# Altium schematic sheet ESP32Schematic[1].SchDoc (part 2 of 3)
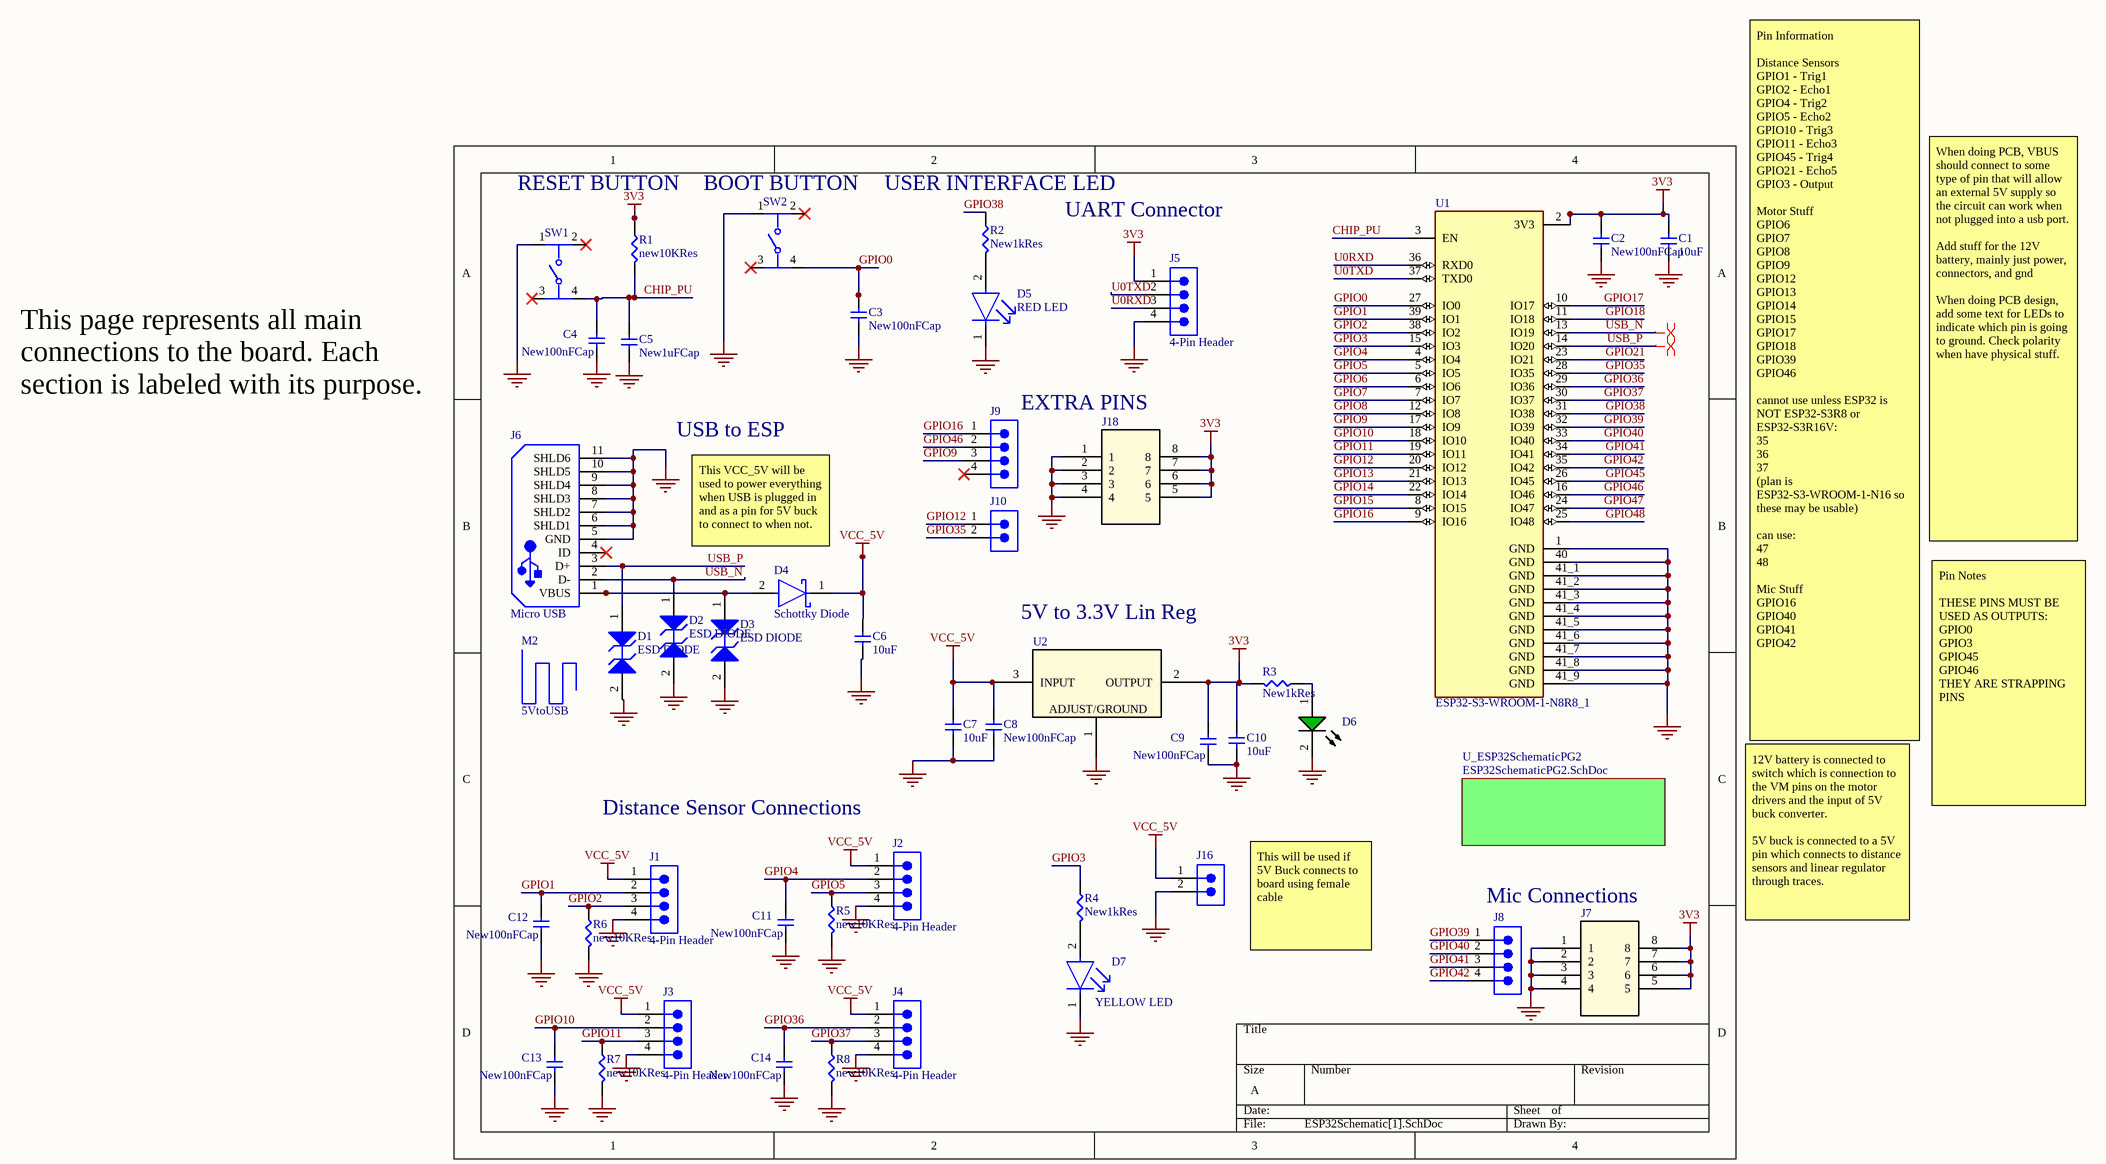
[diagram p1: ESP32Schematic[1].SchDoc]
## Library data of the parts
C1 C6 C7 C10 = C0805C106K3PACTU: 0805 C 10UF Ceramic Multilayer Capacitor, 25 VDC, +85DEGC, X5R Dielec, +/-10%; Manufacturer: KEMET; Value: 10µF; Dissipation Factor: 10%; Voltage: 25V; Supplier: DigiKey; Supplier Part Number: 399-11939-1-ND; Manufacturer Part Number: C0805C106K3PACTU; RoHS: Compliant; Category: Ceramic Capacitors; Stock: 104809; Pricing: 1=0.22, 10=0.126, 50=0.0902, 100=0.0793, 500=0.0609, 1000=0.05524 (USD); Case/Package: 0805; Case Code (Imperial): 0805; Case Code (Metric): 2012; China RoHS: Compliant; Depth: 1.25mm; Dielectric: X5R; Dielectric Material: Ceramic; Height: 1.25mm; Lead Free: Lead Free; Length: 2mm; Lifecycle Status: Production; Material: Ceramic; Max Operating Temperature: 85°C; Min Operating Temperature: -55°C; Mounting Technology: Surface Mount; Number of Terminals: 2; Packaging: Cut Tape; REACH SVHC: Yes; Schedule B: 8532240020; Termination: Solder; Tolerance: 10%; Voltage Rating: 25V; Voltage Rating (DC): 25V; Width: 1.25mm; ComponentLink1URL: https://datasheet.octopart.com:443/C0805C106K3PAC7800-KEMET-datasheet-179100169.pdf?src-supplier=IHS; ComponentLink1Description: https://datasheet.octopart.com:443/C0805C106K3PAC7800-KEMET-datasheet-179100169.pdf?src-supplier=IHS; ComponentLink2URL: https://datasheet.octopart.com:443/C0805C106K3PACTU-KEMET-datasheet-178499189.pdf?src-supplier=IHS; ComponentLink2Description: https://datasheet.octopart.com:443/C0805C106K3PACTU-KEMET-datasheet-178499189.pdf?src-supplier=IHS; ComponentLink3URL: https://datasheet.octopart.com:443/C0805C106K3PACTU-KEMET-datasheet-137357760.pdf?src-supplier=Upverter; ComponentLink3Description: https://datasheet.octopart.com:443/C0805C106K3PACTU-KEMET-datasheet-137357760.pdf?src-supplier=Upverter; ComponentLink4URL: https://datasheet.octopart.com:443/C0805C106K3PACTU-KEMET-datasheet-149523942.pdf?src-supplier=Farnell; ComponentLink4Description: https://datasheet.octopart.com:443/C0805C106K3PACTU-KEMET-datasheet-149523942.pdf?src-supplier=Farnell; ComponentLink5URL: https://datasheet.octopart.com:443/C0805C106K3PACTU-KEMET-datasheet-102649117.pdf?src-supplier=Farnell; ComponentLink5Description: https://datasheet.octopart.com:443/C0805C106K3PACTU-KEMET-datasheet-102649117.pdf?src-supplier=Farnell; ComponentLink6URL: https://datasheet.octopart.com:443/C0805C106K3PACTU-KEMET-datasheet-181957627.pdf?src-supplier=Farnell; ComponentLink6Description: https://datasheet.octopart.com:443/C0805C106K3PACTU-KEMET-datasheet-181957627.pdf?src-supplier=Farnell; ComponentLink7URL: https://datasheet.octopart.com:443/C0805C106K3PACTU-KEMET-datasheet-181957626.pdf?src-supplier=Farnell; ComponentLink7Description: https://datasheet.octopart.com:443/C0805C106K3PACTU-KEMET-datasheet-181957626.pdf?src-supplier=Farnell; ComponentLink8URL: https://datasheet.octopart.com:443/C0805C106K3PACTU-KEMET-datasheet-83957821.pdf?src-supplier=TME; ComponentLink8Description: https://datasheet.octopart.com:443/C0805C106K3PACTU-KEMET-datasheet-83957821.pdf?src-supplier=TME; ComponentLink9URL: https://datasheet.octopart.com:443/C0805C106K3PACTU-KEMET-datasheet-101383854.pdf?src-supplier=TME; ComponentLink9Description: https://datasheet.octopart.com:443/C0805C106K3PACTU-KEMET-datasheet-101383854.pdf?src-supplier=TME; ComponentLink10URL: https://datasheet.octopart.com:443/C0805C106K3PACTU-Kemet-datasheet-46909776.pdf?src-supplier=element14+APAC; ComponentLink10Description: https://datasheet.octopart.com:443/C0805C106K3PACTU-Kemet-datasheet-46909776.pdf?src-supplier=element14+APAC; ComponentLink11URL: https://datasheet.octopart.com:443/C0805C106K3PACTU-Kemet-datasheet-66076755.pdf?src-supplier=element14+APAC; ComponentLink11Description: https://datasheet.octopart.com:443/C0805C106K3PACTU-Kemet-datasheet-66076755.pdf?src-supplier=element14+APAC; ComponentLink12URL: https://datasheet.octopart.com:443/C0805C106K3PACTU-KEMET-datasheet-81638446.pdf?src-supplier=Newark; ComponentLink12Description: https://datasheet.octopart.com:443/C0805C106K3PACTU-KEMET-datasheet-81638446.pdf?src-supplier=Newark; ComponentLink13URL: https://datasheet.octopart.com:443/C0805C106K3PACTU-KEMET-datasheet-176289602.pdf?src-supplier=Newark; ComponentLink13Description: https://datasheet.octopart.com:443/C0805C106K3PACTU-KEMET-datasheet-176289602.pdf?src-supplier=Newark; ComponentLink14URL: https://datasheet.octopart.com:443/C0805C106K3PACTU-KEMET-datasheet-86448548.pdf?src-supplier=Newark; ComponentLink14Description: https://datasheet.octopart.com:443/C0805C106K3PACTU-KEMET-datasheet-86448548.pdf?src-supplier=Newark; ComponentLink15URL: https://datasheet.octopart.com:443/C0805C106K3PACTU-KEMET-datasheet-110724400.pdf?src-supplier=RS+(Formerly+Allied+Electronics); ComponentLink15Description: https://datasheet.octopart.com:443/C0805C106K3PACTU-KEMET-datasheet-110724400.pdf?src-supplier=RS+(Formerly+Allied+Electronics); ComponentLink16URL: https://datasheet.octopart.com/C0805C106K3PACTU-KEMET-datasheet-84169754.pdf; ComponentLink16Description: https://datasheet.octopart.com/C0805C106K3PACTU-KEMET-datasheet-84169754.pdf
C2-C4 C8 C9 C11-C14 = C0805C104K3RACTU: 25V 100nF X7R ±10% 0805 Multilayer Ceramic Capacitors MLCC - SMD/SMT ROHS; Manufacturer: KEMET; Temperature Coefficient: 30ppm/°C; Supplier: DigiKey; Supplier Part Number: 399-C0805C104K3RACTUCT-ND; Manufacturer Part Number: C0805C104K3RACTU; RoHS: Compliant; Category: Ceramic Capacitors; Stock: 1480282; Pricing: 1=0.11, 10=0.062, 50=0.0428, 100=0.0371, 500=0.02736, 1000=0.02438, 4000=0.01952, 8000=0.01719, 12000=0.01709, 20000=0.01653, 28000=0.016, 40000=0.01548, 48000=0.01524, 96000=0.01442, 100000=0.01438 (USD); Value: 100nF; Case/Package: 0805; Case Code (Imperial): 0805; China RoHS: Compliant; Contact Plating: Tin; Depth: 1.25mm; Dielectric: X7R; Dielectric Material: Ceramic; Height: 780µm; Lead Free: Lead Free; Lead Pitch: 750µm; Length: 2mm; Lifecycle Status: Production; Material: Ceramic; Max Operating Temperature: 125°C; Min Operating Temperature: -55°C; Mounting Technology: Surface Mount; Pins: 2; Number of Terminals: 2; Packaging: Cut Tape; Radiation Hardening: No; REACH SVHC: Yes; Schedule B: 8532240020, 8532240020|8532240020|8532240020|8532240020|8532240020; Termination: SMD/SMT; Thickness: 889µm; Tolerance: 10%; Voltage: 25V; Voltage Rating: 25V; Voltage Rating (DC): 25V; Width: 1.25mm; ComponentLink1URL: https://datasheet.octopart.com:443/C0805C104K3RACTU-KEMET-datasheet-178445679.pdf?src-supplier=IHS; ComponentLink1Description: https://datasheet.octopart.com:443/C0805C104K3RACTU-KEMET-datasheet-178445679.pdf?src-supplier=IHS; ComponentLink2URL: https://datasheet.octopart.com:443/C0805C104K3RAC7800-KEMET-datasheet-182041123.pdf?src-supplier=IHS; ComponentLink2Description: https://datasheet.octopart.com:443/C0805C104K3RAC7800-KEMET-datasheet-182041123.pdf?src-supplier=IHS; ComponentLink3URL: https://datasheet.octopart.com:443/C0805C104K3RACTU-KEMET-datasheet-137357759.pdf?src-supplier=Farnell; ComponentLink3Description: https://datasheet.octopart.com:443/C0805C104K3RACTU-KEMET-datasheet-137357759.pdf?src-supplier=Farnell; ComponentLink4URL: https://datasheet.octopart.com:443/C0805C104K3RAC-TU-Kemet-datasheet-5313890.pdf?src-supplier=Farnell; ComponentLink4Description: https://datasheet.octopart.com:443/C0805C104K3RAC-TU-Kemet-datasheet-5313890.pdf?src-supplier=Farnell; ComponentLink5URL: https://datasheet.octopart.com:443/C0805C104K3RACTU-KEMET-datasheet-100437323.pdf?src-supplier=Farnell; ComponentLink5Description: https://datasheet.octopart.com:443/C0805C104K3RACTU-KEMET-datasheet-100437323.pdf?src-supplier=Farnell; ComponentLink6URL: https://datasheet.octopart.com:443/C0805C104K3RACTU-KEMET-datasheet-176142295.pdf?src-supplier=Farnell; ComponentLink6Description: https://datasheet.octopart.com:443/C0805C104K3RACTU-KEMET-datasheet-176142295.pdf?src-supplier=Farnell; ComponentLink7URL: https://datasheet.octopart.com:443/C0805C104K3RAC-TU-Kemet-datasheet-7833651.pdf?src-supplier=Farnell; ComponentLink7Description: https://datasheet.octopart.com:443/C0805C104K3RAC-TU-Kemet-datasheet-7833651.pdf?src-supplier=Farnell; ComponentLink8URL: https://datasheet.octopart.com:443/C0805C104K3RAC-TU-Kemet-datasheet-7601896.pdf?src-supplier=Farnell; ComponentLink8Description: https://datasheet.octopart.com:443/C0805C104K3RAC-TU-Kemet-datasheet-7601896.pdf?src-supplier=Farnell; ComponentLink9URL: https://datasheet.octopart.com:443/C0805C104K3RAC-TU-Kemet-datasheet-5316294.pdf?src-supplier=Farnell; ComponentLink9Description: https://datasheet.octopart.com:443/C0805C104K3RAC-TU-Kemet-datasheet-5316294.pdf?src-supplier=Farnell; ComponentLink10URL: https://datasheet.octopart.com:443/C0805C104K3RAC-TU-Kemet-datasheet-5314837.pdf?src-supplier=Farnell; ComponentLink10Description: https://datasheet.octopart.com:443/C0805C104K3RAC-TU-Kemet-datasheet-5314837.pdf?src-supplier=Farnell; ComponentLink11URL: https://datasheet.octopart.com:443/C0805C104K3RAC-TU-Kemet-datasheet-8092359.pdf?src-supplier=Farnell; ComponentLink11Description: https://datasheet.octopart.com:443/C0805C104K3RAC-TU-Kemet-datasheet-8092359.pdf?src-supplier=Farnell; ComponentLink12URL: https://datasheet.octopart.com:443/C0805C104K3RAC-TU-Kemet-datasheet-5314449.pdf?src-supplier=Farnell; ComponentLink12Description: https://datasheet.octopart.com:443/C0805C104K3RAC-TU-Kemet-datasheet-5314449.pdf?src-supplier=Farnell; ComponentLink13URL: https://datasheet.octopart.com:443/C0805C104K3RAC-TU-Kemet-datasheet-5390537.pdf?src-supplier=Farnell; ComponentLink13Description: https://datasheet.octopart.com:443/C0805C104K3RAC-TU-Kemet-datasheet-5390537.pdf?src-supplier=Farnell; ComponentLink14URL: https://datasheet.octopart.com:443/C0805C104K3RAC-TU-Kemet-datasheet-5314969.pdf?src-supplier=Farnell; ComponentLink14Description: https://datasheet.octopart.com:443/C0805C104K3RAC-TU-Kemet-datasheet-5314969.pdf?src-supplier=Farnell; ComponentLink15URL: https://datasheet.octopart.com:443/C0805C104K3RAC-TU-Kemet-datasheet-5314627.pdf?src-supplier=Farnell; ComponentLink15Description: https://datasheet.octopart.com:443/C0805C104K3RAC-TU-Kemet-datasheet-5314627.pdf?src-supplier=Farnell; ComponentLink16URL: https://datasheet.octopart.com:443/C0805C104K3RAC-TU-Kemet-datasheet-5389132.pdf?src-supplier=Farnell; ComponentLink16Description: https://datasheet.octopart.com:443/C0805C104K3RAC-TU-Kemet-datasheet-5389132.pdf?src-supplier=Farnell; ComponentLink17URL: https://datasheet.octopart.com:443/C0805C104K3RAC-TU-Kemet-datasheet-5313836.pdf?src-supplier=Farnell; ComponentLink17Description: https://datasheet.octopart.com:443/C0805C104K3RAC-TU-Kemet-datasheet-5313836.pdf?src-supplier=Farnell; ComponentLink18URL: https://datasheet.octopart.com:443/C0805C104K3RAC-TU-Kemet-datasheet-8111010.pdf?src-supplier=Farnell; ComponentLink18Description: https://datasheet.octopart.com:443/C0805C104K3RAC-TU-Kemet-datasheet-8111010.pdf?src-supplier=Farnell; ComponentLink19URL: https://datasheet.octopart.com:443/C0805C104K3RAC-TU-Kemet-datasheet-7541751.pdf?src-supplier=Farnell; ComponentLink19Description: https://datasheet.octopart.com:443/C0805C104K3RAC-TU-Kemet-datasheet-7541751.pdf?src-supplier=Farnell; ComponentLink20URL: https://datasheet.octopart.com:443/C0805C104K3RAC-TU-Kemet-datasheet-7627733.pdf?src-supplier=Farnell; ComponentLink20Description: https://datasheet.octopart.com:443/C0805C104K3RAC-TU-Kemet-datasheet-7627733.pdf?src-supplier=Farnell; ComponentLink21URL: https://datasheet.octopart.com:443/C0805C104K3RAC-TU-Kemet-datasheet-5315946.pdf?src-supplier=Farnell; ComponentLink21Description: https://datasheet.octopart.com:443/C0805C104K3RAC-TU-Kemet-datasheet-5315946.pdf?src-supplier=Farnell; ComponentLink22URL: https://datasheet.octopart.com:443/C0805C104K3RACTU-KEMET-datasheet-68331921.pdf?src-supplier=Upverter; ComponentLink22Description: https://datasheet.octopart.com:443/C0805C104K3RACTU-KEMET-datasheet-68331921.pdf?src-supplier=Upverter; ComponentLink23URL: https://datasheet.octopart.com:443/C0805C104K3RACTU-Kemet-datasheet-12608295.pdf?src-supplier=element14+APAC; ComponentLink23Description: https://datasheet.octopart.com:443/C0805C104K3RACTU-Kemet-datasheet-12608295.pdf?src-supplier=element14+APAC; ComponentLink24URL: https://datasheet.octopart.com:443/C0805C104K3RACTU-Kemet-datasheet-11992184.pdf?src-supplier=element14+APAC; ComponentLink24Description: https://datasheet.octopart.com:443/C0805C104K3RACTU-Kemet-datasheet-11992184.pdf?src-supplier=element14+APAC; ComponentLink25URL: https://datasheet.octopart.com:443/C0805C104K3RACTU-Kemet-datasheet-10942409.pdf?src-supplier=element14+APAC; ComponentLink25Description: https://datasheet.octopart.com:443/C0805C104K3RACTU-Kemet-datasheet-10942409.pdf?src-supplier=element14+APAC; ComponentLink26URL: https://datasheet.octopart.com:443/C0805C104K3RACTU-Kemet-datasheet-10404442.pdf?src-supplier=element14+APAC; ComponentLink26Description: https://datasheet.octopart.com:443/C0805C104K3RACTU-Kemet-datasheet-10404442.pdf?src-supplier=element14+APAC; ComponentLink27URL: https://datasheet.octopart.com:443/C0805C104K3RACTU-Kemet-datasheet-66100807.pdf?src-supplier=element14+APAC; ComponentLink27Description: https://datasheet.octopart.com:443/C0805C104K3RACTU-Kemet-datasheet-66100807.pdf?src-supplier=element14+APAC; ComponentLink28URL: https://datasheet.octopart.com:443/C0805C104K3RACTU-Kemet-datasheet-32036385.pdf?src-supplier=element14+APAC; ComponentLink28Description: https://datasheet.octopart.com:443/C0805C104K3RACTU-Kemet-datasheet-32036385.pdf?src-supplier=element14+APAC; ComponentLink29URL: https://datasheet.octopart.com:443/C0805C104K3RACTU-KEMET-datasheet-37550250.pdf?src-supplier=Electro+Sonic; ComponentLink29Description: https://datasheet.octopart.com:443/C0805C104K3RACTU-KEMET-datasheet-37550250.pdf?src-supplier=Electro+Sonic; ComponentLink30URL: https://datasheet.octopart.com:443/C0805C104K3RACTU-KEMET-datasheet-176289588.pdf?src-supplier=Newark; ComponentLink30Description: https://datasheet.octopart.com:443/C0805C104K3RACTU-KEMET-datasheet-176289588.pdf?src-supplier=Newark; ComponentLink31URL: https://datasheet.octopart.com:443/C0805C104K3RACTU-Kemet-datasheet-27203261.pdf?src-supplier=Newark; ComponentLink31Description: https://datasheet.octopart.com:443/C0805C104K3RACTU-Kemet-datasheet-27203261.pdf?src-supplier=Newark; ComponentLink32URL: https://datasheet.octopart.com:443/C0805C104K3RACTU-KEMET-datasheet-164512540.pdf?src-supplier=TME; ComponentLink32Description: https://datasheet.octopart.com:443/C0805C104K3RACTU-KEMET-datasheet-164512540.pdf?src-supplier=TME; ComponentLink33URL: https://datasheet.octopart.com:443/C0805C104K3RACTU-Kemet-datasheet-67847105.pdf?src-supplier=TME; ComponentLink33Description: https://datasheet.octopart.com:443/C0805C104K3RACTU-Kemet-datasheet-67847105.pdf?src-supplier=TME; ComponentLink34URL: https://datasheet.octopart.com:443/C0805C104K3RACTU-KEMET-datasheet-68331906.pdf?src-supplier=TME; ComponentLink34Description: https://datasheet.octopart.com:443/C0805C104K3RACTU-KEMET-datasheet-68331906.pdf?src-supplier=TME; ComponentLink35URL: https://datasheet.octopart.com:443/C0805C104K3RACTU-KEMET-datasheet-110724412.pdf?src-supplier=RS+(Formerly+Allied+Electronics); ComponentLink35Description: https://datasheet.octopart.com:443/C0805C104K3RACTU-KEMET-datasheet-110724412.pdf?src-supplier=RS+(Formerly+Allied+Electronics); ComponentLink36URL: https://datasheet.octopart.com:443/C0805C104K3RACTU-Kemet-datasheet-464.pdf?src-supplier=RS+(Formerly+Allied+Electronics); ComponentLink36Description: https://datasheet.octopart.com:443/C0805C104K3RACTU-Kemet-datasheet-464.pdf?src-supplier=RS+(Formerly+Allied+Electronics); ComponentLink37URL: https://datasheet.octopart.com/C0805C104K3RACTU-KEMET-datasheet-84169754.pdf; ComponentLink37Description: https://datasheet.octopart.com/C0805C104K3RACTU-KEMET-datasheet-84169754.pdf; ComponentLink38URL: https://datasheet.octopart.com:443/C0805C104K3RACTU-Kemet-datasheet-11780474.pdf?src-supplier=Arrow+Electronics; ComponentLink38Description: https://datasheet.octopart.com:443/C0805C104K3RACTU-Kemet-datasheet-11780474.pdf?src-supplier=Arrow+Electronics; ComponentLink39URL: https://datasheet.octopart.com:443/C0805C104K3RAC-TU-Kemet-datasheet-7628246.pdf?src-supplier=Jameco; ComponentLink39Description: https://datasheet.octopart.com:443/C0805C104K3RAC-TU-Kemet-datasheet-7628246.pdf?src-supplier=Jameco
C5 = C0805C105K3RACTU: Multilayer Ceramic Capacitors MLCC – SMD/SMT; KEMET; C0805C105K3RACTU; 1 µF; 0805; 25 V; 25 V; Value: 1µF; Dielectric: X7R; Tolerance: 10%; Voltage: 25V; Supplier: DigiKey; Supplier Part Number: 399-C0805C105K3RACTUDKR-ND; Manufacturer: KEMET; Manufacturer Part Number: C0805C105K3RACTU; RoHS: Compliant; Category: Ceramic Capacitors; Stock: 337068; Pricing: 1=0.12, 10=0.068, 50=0.0474, 100=0.041, 500=0.03044, 1000=0.02719 (USD); Case/Package: 0805; Case Code (Imperial): 0805; Case Code (Metric): 2012; China RoHS: Compliant; Contact Plating: Tin; Depth: 1.25mm; Dielectric Material: Ceramic; Height: 1.25mm; Length: 2mm; Lifecycle Status: Production; Material: Ceramic; Max Operating Temperature: 125°C; Min Operating Temperature: -55°C; Mounting Technology: Surface Mount; Pins: 2; Number of Terminals: 2; Radiation Hardening: No; REACH SVHC: Yes; Schedule B: 8532240020, 8532240020|8532240020|8532240020|8532240020|8532240020|8532240020|8532240020|8532240020|8532240020|8532240020|8532240020|8532240020|8532240020|8532240020|8532240020|8532240020|8532240020|8532240020|8532240020|8532240020|8532240020|8532240020|8532240020|85; Termination: SMD/SMT; Thickness: 1.397mm; Voltage Rating: 25V; Voltage Rating (DC): 25V; Width: 1.25mm; ComponentLink1URL: https://datasheet.octopart.com:443/C0805C105K3RACTU-KEMET-datasheet-178445679.pdf?src-supplier=IHS; ComponentLink1Description: https://datasheet.octopart.com:443/C0805C105K3RACTU-KEMET-datasheet-178445679.pdf?src-supplier=IHS; ComponentLink2URL: https://datasheet.octopart.com:443/C0805C105K3RACTU-KEMET-datasheet-137357759.pdf?src-supplier=Farnell; ComponentLink2Description: https://datasheet.octopart.com:443/C0805C105K3RACTU-KEMET-datasheet-137357759.pdf?src-supplier=Farnell; ComponentLink3URL: https://datasheet.octopart.com:443/C0805C105K3RACTU-Kemet-datasheet-5313890.pdf?src-supplier=Farnell; ComponentLink3Description: https://datasheet.octopart.com:443/C0805C105K3RACTU-Kemet-datasheet-5313890.pdf?src-supplier=Farnell; ComponentLink4URL: https://datasheet.octopart.com:443/C0805C105K3RACTU-KEMET-datasheet-32036385.pdf?src-supplier=Farnell; ComponentLink4Description: https://datasheet.octopart.com:443/C0805C105K3RACTU-KEMET-datasheet-32036385.pdf?src-supplier=Farnell; ComponentLink5URL: https://datasheet.octopart.com:443/C0805C105K3RACTU-Kemet-datasheet-8764837.pdf?src-supplier=Farnell; ComponentLink5Description: https://datasheet.octopart.com:443/C0805C105K3RACTU-Kemet-datasheet-8764837.pdf?src-supplier=Farnell; ComponentLink6URL: https://datasheet.octopart.com:443/C0805C105K3RACTU-Kemet-datasheet-8480123.pdf?src-supplier=Farnell; ComponentLink6Description: https://datasheet.octopart.com:443/C0805C105K3RACTU-Kemet-datasheet-8480123.pdf?src-supplier=Farnell; ComponentLink7URL: https://datasheet.octopart.com:443/C0805C105K3RACTU-Kemet-datasheet-5390537.pdf?src-supplier=Farnell; ComponentLink7Description: https://datasheet.octopart.com:443/C0805C105K3RACTU-Kemet-datasheet-5390537.pdf?src-supplier=Farnell; ComponentLink8URL: https://datasheet.octopart.com:443/C0805C105K3RACTU-Kemet-datasheet-5393970.pdf?src-supplier=Farnell; ComponentLink8Description: https://datasheet.octopart.com:443/C0805C105K3RACTU-Kemet-datasheet-5393970.pdf?src-supplier=Farnell; ComponentLink9URL: https://datasheet.octopart.com:443/C0805C105K3RACTU-Kemet-datasheet-8502025.pdf?src-supplier=Farnell; ComponentLink9Description: https://datasheet.octopart.com:443/C0805C105K3RACTU-Kemet-datasheet-8502025.pdf?src-supplier=Farnell; ComponentLink10URL: https://datasheet.octopart.com:443/C0805C105K3RACTU-Kemet-datasheet-7541751.pdf?src-supplier=Farnell; ComponentLink10Description: https://datasheet.octopart.com:443/C0805C105K3RACTU-Kemet-datasheet-7541751.pdf?src-supplier=Farnell; ComponentLink11URL: https://datasheet.octopart.com:443/C0805C105K3RACTU-Kemet-datasheet-161801.pdf?src-supplier=Farnell; ComponentLink11Description: https://datasheet.octopart.com:443/C0805C105K3RACTU-Kemet-datasheet-161801.pdf?src-supplier=Farnell; ComponentLink12URL: https://datasheet.octopart.com:443/C0805C105K3RACTU-KEMET-datasheet-149523912.pdf?src-supplier=Farnell; ComponentLink12Description: https://datasheet.octopart.com:443/C0805C105K3RACTU-KEMET-datasheet-149523912.pdf?src-supplier=Farnell; ComponentLink13URL: https://datasheet.octopart.com:443/C0805C105K3RACTU-KEMET-datasheet-68331906.pdf?src-supplier=Farnell; ComponentLink13Description: https://datasheet.octopart.com:443/C0805C105K3RACTU-KEMET-datasheet-68331906.pdf?src-supplier=Farnell; ComponentLink14URL: https://datasheet.octopart.com:443/C0805C105K3RACTU-KEMET-datasheet-101576158.pdf?src-supplier=Farnell; ComponentLink14Description: https://datasheet.octopart.com:443/C0805C105K3RACTU-KEMET-datasheet-101576158.pdf?src-supplier=Farnell; ComponentLink15URL: https://datasheet.octopart.com:443/C0805C105K3RACTU.-Kemet-datasheet-41232427.pdf?src-supplier=Farnell; ComponentLink15Description: https://datasheet.octopart.com:443/C0805C105K3RACTU.-Kemet-datasheet-41232427.pdf?src-supplier=Farnell; ComponentLink16URL: https://datasheet.octopart.com:443/C0805C105K3RACTU-KEMET-datasheet-176142298.pdf?src-supplier=Farnell; ComponentLink16Description: https://datasheet.octopart.com:443/C0805C105K3RACTU-KEMET-datasheet-176142298.pdf?src-supplier=Farnell; ComponentLink17URL: https://datasheet.octopart.com:443/C0805C105K3RACTU-Kemet-datasheet-5340275.pdf?src-supplier=Farnell; ComponentLink17Description: https://datasheet.octopart.com:443/C0805C105K3RACTU-Kemet-datasheet-5340275.pdf?src-supplier=Farnell; ComponentLink18URL: https://datasheet.octopart.com:443/C0805C105K3RAC7800-KEMET-datasheet-188512054.pdf?src-supplier=ODG+(Origin+Data+Global); ComponentLink18Description: https://datasheet.octopart.com:443/C0805C105K3RAC7800-KEMET-datasheet-188512054.pdf?src-supplier=ODG+(Origin+Data+Global); ComponentLink19URL: https://datasheet.octopart.com:443/C0805C105K3RACTU..-Kemet-datasheet-66413465.pdf?src-supplier=element14+APAC; ComponentLink19Description: https://datasheet.octopart.com:443/C0805C105K3RACTU..-Kemet-datasheet-66413465.pdf?src-supplier=element14+APAC; ComponentLink20URL: https://datasheet.octopart.com:443/C0805C105K3RACTU-Kemet-datasheet-23692949.pdf?src-supplier=element14+APAC; ComponentLink20Description: https://datasheet.octopart.com:443/C0805C105K3RACTU-Kemet-datasheet-23692949.pdf?src-supplier=element14+APAC; ComponentLink21URL: https://datasheet.octopart.com:443/C0805C105K3RACTU-Kemet-datasheet-22084244.pdf?src-supplier=element14+APAC; ComponentLink21Description: https://datasheet.octopart.com:443/C0805C105K3RACTU-Kemet-datasheet-22084244.pdf?src-supplier=element14+APAC; ComponentLink22URL: https://datasheet.octopart.com:443/C0805C105K3RACTU-KEMET-datasheet-176289598.pdf?src-supplier=Newark; ComponentLink22Description: https://datasheet.octopart.com:443/C0805C105K3RACTU-KEMET-datasheet-176289598.pdf?src-supplier=Newark; ComponentLink23URL: https://datasheet.octopart.com:443/C0805C105K3RACTU-Kemet-datasheet-12608295.pdf?src-supplier=Newark; ComponentLink23Description: https://datasheet.octopart.com:443/C0805C105K3RACTU-Kemet-datasheet-12608295.pdf?src-supplier=Newark; ComponentLink24URL: https://datasheet.octopart.com:443/C0805C105K3RACTU-Kemet-datasheet-11992184.pdf?src-supplier=Newark; ComponentLink24Description: https://datasheet.octopart.com:443/C0805C105K3RACTU-Kemet-datasheet-11992184.pdf?src-supplier=Newark; ComponentLink25URL: https://datasheet.octopart.com:443/C0805C105K3RACTU-Kemet-datasheet-10942409.pdf?src-supplier=Newark; ComponentLink25Description: https://datasheet.octopart.com:443/C0805C105K3RACTU-Kemet-datasheet-10942409.pdf?src-supplier=Newark; ComponentLink26URL: https://datasheet.octopart.com:443/C0805C105K3RACTU-Kemet-datasheet-10404442.pdf?src-supplier=Newark; ComponentLink26Description: https://datasheet.octopart.com:443/C0805C105K3RACTU-Kemet-datasheet-10404442.pdf?src-supplier=Newark; ComponentLink27URL: https://datasheet.octopart.com:443/C0805C105K3RACTU-KEMET-datasheet-164512540.pdf?src-supplier=TME; ComponentLink27Description: https://datasheet.octopart.com:443/C0805C105K3RACTU-KEMET-datasheet-164512540.pdf?src-supplier=TME; ComponentLink28URL: https://datasheet.octopart.com:443/C0805C105K3RACTU-Kemet-datasheet-67847111.pdf?src-supplier=TME; ComponentLink28Description: https://datasheet.octopart.com:443/C0805C105K3RACTU-Kemet-datasheet-67847111.pdf?src-supplier=TME; ComponentLink29URL: https://datasheet.octopart.com:443/C0805C105K3RACTU-KEMET-datasheet-110724412.pdf?src-supplier=RS+(Formerly+Allied+Electronics); ComponentLink29Description: https://datasheet.octopart.com:443/C0805C105K3RACTU-KEMET-datasheet-110724412.pdf?src-supplier=RS+(Formerly+Allied+Electronics); ComponentLink30URL: https://datasheet.octopart.com:443/C0805C105K3RACTU-Kemet-datasheet-464.pdf?src-supplier=RS+(Formerly+Allied+Electronics); ComponentLink30Description: https://datasheet.octopart.com:443/C0805C105K3RACTU-Kemet-datasheet-464.pdf?src-supplier=RS+(Formerly+Allied+Electronics); ComponentLink31URL: https://datasheet.octopart.com/C0805C105K3RACTU-KEMET-datasheet-84169754.pdf; ComponentLink31Description: https://datasheet.octopart.com/C0805C105K3RACTU-KEMET-datasheet-84169754.pdf; ComponentLink32URL: https://datasheet.octopart.com:443/C0805C105K3RACTU-Kemet-datasheet-11765922.pdf?src-supplier=Arrow+Electronics; ComponentLink32Description: https://datasheet.octopart.com:443/C0805C105K3RACTU-Kemet-datasheet-11765922.pdf?src-supplier=Arrow+Electronics; ComponentLink33URL: https://datasheet.octopart.com:443/C0805C105K3RAC7800-KEMET-datasheet-164857143.pdf?src-supplier=Burklin+Elektronik; ComponentLink33Description: https://datasheet.octopart.com:443/C0805C105K3RAC7800-KEMET-datasheet-164857143.pdf?src-supplier=Burklin+Elektronik
D1-D3 = ESD9B5.0ST5G: 5.8V Bidirectional 5V SOD-923 ESD and Surge Protection (TVS/ESD) ROHS; Manufacturer: onsemi; Manufacturer Lifecycle Status: ACTIVE; Breakdown Voltage: 6.8V; Value: 15pF; Clamping Voltage: 12.5V; Element Configuration: Single; ESD Protection: Yes; Leakage Current: 1µA; Max Breakdown Voltage: 7.8V; Max Junction Temperature (Tj): 150°C; Max Power Dissipation: 300mW; Max Surge Current: 1A; Number of Bidirectional Channels: 1; Peak Pulse Current: 2A; Peak Reverse Current: 100nA; Polarity: Unidirectional; Power Line Protection: No; Test Current: 1mA; Supplier: DigiKey; Supplier Part Number: ESD9B5.0ST5GOSCT-ND; Manufacturer Part Number: ESD9B5.0ST5G; RoHS: Compliant; Category: TVS Diodes; Stock: 480940; Pricing: 1=0.1, 10=0.018 (USD); Case/Package: SOD-923-2; China RoHS: Compliant; Composition: Zener; Contact Plating: Tin; Depth: 600µm; Direction: Bidirectional; Halogen Free: Halogen Free; Height: 400µm; Lead Free: Lead Free; Length: 800µm; Lifecycle Status: Production; Max Operating Temperature: 150°C; Max Reverse Leakage Current: 1µA; Min Breakdown Voltage: 5.8V; Min Operating Temperature: -55°C; Number of Channels: 1; Number of Elements: 1; Number of Lines: 1; Pins: 2; Number of Terminals: 2; Operating Supply Voltage: 5V; Packaging: Tape and Reel; Peak Pulse Power: 300mW; Radiation Hardening: No; REACH SVHC: Yes; Reverse Breakdown Voltage: 5.8V; Reverse Standoff Voltage: 5V; Schedule B: 8536300000, 8536300000|8536300000|8536300000|8536300000|8536300000|8536300000|8536300000|8536300000|8536300000|8536300000|8536300000|8536300000|8536300000|8536300000|8536300000|8536300000|8536300000|8536300000|8536300000|8536300000|8536300000|8536300000|8536300000|85; Termination: SMD/SMT; Width: 650µm; Working Voltage: 5V; ComponentLink1URL: https://datasheet.octopart.com:443/ESD9B5.0ST5G-onsemi-datasheet-180958915.pdf?src-supplier=IHS; ComponentLink1Description: https://datasheet.octopart.com:443/ESD9B5.0ST5G-onsemi-datasheet-180958915.pdf?src-supplier=IHS; ComponentLink2URL: https://datasheet.octopart.com:443/ESD9B5.0ST5G-ON-Semiconductor-datasheet-102157924.pdf?src-supplier=Upverter; ComponentLink2Description: https://datasheet.octopart.com:443/ESD9B5.0ST5G-ON-Semiconductor-datasheet-102157924.pdf?src-supplier=Upverter; ComponentLink3URL: https://datasheet.octopart.com:443/ESD9B5.0ST5G-onsemi-datasheet-164326709.pdf?src-supplier=Upverter; ComponentLink3Description: https://datasheet.octopart.com:443/ESD9B5.0ST5G-onsemi-datasheet-164326709.pdf?src-supplier=Upverter; ComponentLink4URL: https://sigma.octopart.com:443/141945501/technical_drawing/onsemi-ESD9B5.0ST5G.pdf?src-supplier=Upverter; ComponentLink4Description: https://sigma.octopart.com:443/141945501/technical_drawing/onsemi-ESD9B5.0ST5G.pdf?src-supplier=Upverter; ComponentLink5URL: https://datasheet.octopart.com:443/ESD9B5.0ST5G-ON-Semiconductor-datasheet-31820553.pdf?src-supplier=Upverter; ComponentLink5Description: https://datasheet.octopart.com:443/ESD9B5.0ST5G-ON-Semiconductor-datasheet-31820553.pdf?src-supplier=Upverter; ComponentLink6URL: https://datasheet.octopart.com:443/ESD9B5.0ST5G-ON-Semiconductor-datasheet-10979971.pdf?src-supplier=JRH+Electronics; ComponentLink6Description: https://datasheet.octopart.com:443/ESD9B5.0ST5G-ON-Semiconductor-datasheet-10979971.pdf?src-supplier=JRH+Electronics; ComponentLink7URL: https://datasheet.octopart.com:443/ESD9B5.0ST5G-ON-Semiconductor-datasheet-43892613.pdf?src-supplier=Newark; ComponentLink7Description: https://datasheet.octopart.com:443/ESD9B5.0ST5G-ON-Semiconductor-datasheet-43892613.pdf?src-supplier=Newark; ComponentLink8URL: https://datasheet.octopart.com:443/ESD9B5.0ST5G-ON-Semiconductor-datasheet-8324281.pdf?src-supplier=Farnell; ComponentLink8Description: https://datasheet.octopart.com:443/ESD9B5.0ST5G-ON-Semiconductor-datasheet-8324281.pdf?src-supplier=Farnell; ComponentLink9URL: https://datasheet.octopart.com:443/ESD9B5.0ST5G-onsemi-datasheet-164731318.pdf?src-supplier=ODG+(Origin+Data+Global); ComponentLink9Description: https://datasheet.octopart.com:443/ESD9B5.0ST5G-onsemi-datasheet-164731318.pdf?src-supplier=ODG+(Origin+Data+Global); ComponentLink10URL: https://datasheet.octopart.com:443/ESD9B5.0ST5G-ON-Semiconductor-datasheet-14050548.pdf?src-supplier=iiiC; ComponentLink10Description: https://datasheet.octopart.com:443/ESD9B5.0ST5G-ON-Semiconductor-datasheet-14050548.pdf?src-supplier=iiiC; ComponentLink11URL: http://sigma.octopart.com:80/15540786/rohs_certificate/ON-Semiconductor-ESD9B5.0ST5G.pdf?src-supplier=Compliance+Statements; ComponentLink11Description: http://sigma.octopart.com:80/15540786/rohs_certificate/ON-Semiconductor-ESD9B5.0ST5G.pdf?src-supplier=Compliance+Statements; ComponentLink12URL: http://sigma.octopart.com:80/15676168/materials_sheet/ON-Semiconductor-ESD9B5.0ST5G.csv?src-supplier=Compliance+Statements; ComponentLink12Description: http://sigma.octopart.com:80/15676168/materials_sheet/ON-Semiconductor-ESD9B5.0ST5G.csv?src-supplier=Compliance+Statements; ComponentLink13URL: http://sigma.octopart.com:80/150607598/rohs_statement/ON-Semiconductor-ESD9B5.0ST5G.pdf?src-supplier=Compliance+Statements; ComponentLink13Description: http://sigma.octopart.com:80/150607598/rohs_statement/ON-Semiconductor-ESD9B5.0ST5G.pdf?src-supplier=Compliance+Statements; ComponentLink14URL: http://sigma.octopart.com:80/reach_statement/ON-Semiconductor-company-79.pdf?src-supplier=Compliance+Statements; ComponentLink14Description: http://sigma.octopart.com:80/reach_statement/ON-Semiconductor-company-79.pdf?src-supplier=Compliance+Statements; ComponentLink15URL: https://octopart.com:443/opatz8j6/c1?t=XtpWH1-n59Nv97GpxeIMeHBNoxt5g4S9bQ9QnT6FqtsvICeTGkSw5iyTUKBLo0IreNXT5t3AMffPQ0sdNKdknHOm0nz1F09QQR3mOZmgbbFWUrY4RF3x-bhmC_Z-XjWywbxv9QDvbwvhpgGaRWZ5lQqCl3K795s9mZLZ92Wvm06CQ47iAhAwJvQ9SkryRdQoBq0pMJNPiTEI8WXrEODmoHD5ktIehnxnaf8ca6nm1MFYDk6vo6g3Leelyy63yO-FU8WMhohDT9xT0SK97mH-4J-vryFITMukHi1AYkEKV-tK_HgJsBQue_0FPI1KRnbIF_8MedQFCTScKvzDmqBnhH-esSUU19M39aV-Hye4&src-supplier=Compliance+Statements; ComponentLink15Description: https://octopart.com:443/opatz8j6/c1?t=XtpWH1-n59Nv97GpxeIMeHBNoxt5g4S9bQ9QnT6FqtsvICeTGkSw5iyTUKBLo0IreNXT5t3AMffPQ0sdNKdknHOm0nz1F09QQR3mOZmgbbFWUrY4RF3x-bhmC_Z-XjWywbxv9QDvbwvhpgGaRWZ5lQqCl3K795s9mZLZ92Wvm06CQ47iAhAwJvQ9SkryRdQoBq0pMJNPiTEI8WXrEODmoHD5ktIehnxnaf8ca6nm1MFYDk6vo6g3Leelyy63yO-FU8WMhohDT9xT0SK97mH-4J-vryFITMukHi1AYkEKV-tK_HgJsBQue_0FPI1KRnbIF_8MedQFCTScKvzDmqBnhH-esSUU19M39aV-Hye4&src-supplier=Compliance+Statements; ComponentLink16URL: https://octopart.com:443/opatz8j6/c1?t=ukQZya117aficN5Owusg0RdHerDMW0hZBhe1r8m_np9fwSIxwBwHeh5-IvO_UWXWH3WcOOwp_gPK3N92O5SqqlJVydiayIStyFqQOvO-Hbhs0kY7GI_m-bAamyuzgyxbeoYYxS3z_UnhuNSquB5LezYHRAQLi67e8aJSNvNkUDJzh5ZU-Qy774PXzfKH9SwEUqfzjA30ZQvTVW1KskQAX5jdhheWoVajRRb1L5lwmDODTRwD4XPTboWpzb6nOMmLPVjRCgqhZes7YdPyVxDRq8iBNm7wgEfc16MtwkTc6-eeNDmlCq1LVMxYxr7YSEfDWt893Z6Wt1Oi2NurFZ39qJh1jVO1gjbLWIchtW_FmA&src-supplier=Compliance+Statements; ComponentLink16Description: https://octopart.com:443/opatz8j6/c1?t=ukQZya117aficN5Owusg0RdHerDMW0hZBhe1r8m_np9fwSIxwBwHeh5-IvO_UWXWH3WcOOwp_gPK3N92O5SqqlJVydiayIStyFqQOvO-Hbhs0kY7GI_m-bAamyuzgyxbeoYYxS3z_UnhuNSquB5LezYHRAQLi67e8aJSNvNkUDJzh5ZU-Qy774PXzfKH9SwEUqfzjA30ZQvTVW1KskQAX5jdhheWoVajRRb1L5lwmDODTRwD4XPTboWpzb6nOMmLPVjRCgqhZes7YdPyVxDRq8iBNm7wgEfc16MtwkTc6-eeNDmlCq1LVMxYxr7YSEfDWt893Z6Wt1Oi2NurFZ39qJh1jVO1gjbLWIchtW_FmA&src-supplier=Compliance+Statements
D4 = 1N5819HW-7-F: 1N5819HW Series 40 V 1 A Surface Mount Schottky Barrier Rectifier - SOD-123; Manufacturer: Diodes Inc.; Average Rectified Current: 1A; Value: 50pF; Element Configuration: Single; Forward Voltage: 750mV; Max Forward Surge Current (Ifsm): 25A; Max Junction Temperature (Tj): 125°C; Max Power Dissipation: 450mW; Max Repetitive Reverse Voltage (Vrrm): 40V; Number of Elements: 1; Peak Reverse Current: 1mA; Polarity: Standard; Supplier: DigiKey; Supplier Part Number: 1N5819HW-FDIDKR-ND; Manufacturer Part Number: 1N5819HW-7-F; RoHS: Compliant; Category: Schottky Diodes; Stock: 229353; Pricing: 1=0.29, 10=0.166, 100=0.1036, 500=0.07624, 1000=0.06736 (USD); Case/Package: SOD-123-2; China RoHS: Compliant; Contact Plating: Tin; Current Rating: 1A; Forward Current: 1A; Height: 1.45mm; Lead Free: Lead Free; Length: 2.85mm; Lifecycle Status: Production; Max Operating Temperature: 125°C; Max Output current: 1A; Max Reverse Voltage (DC): 40V; Min Breakdown Voltage: 40V; Min Operating Temperature: -65°C; Pins: 2; Number of Terminals: 2; Output Current: 1A; Packaging: Tape and Reel; Peak Non-Repetitive Surge Current: 25A; Radiation Hardening: No; REACH SVHC: Yes; Reverse Standoff Voltage: 40V; Reverse Voltage: 40V; Schedule B: 8541100080, 8541100080|8541100080|8541100080|8541100080|8541100080; Termination: SMD/SMT; Voltage Rating (DC): 40V; Weight: 10.007382mg; Width: 1.7mm; ComponentLink1URL: https://datasheet.octopart.com:443/1N5819HW-7-F-Diodes-Inc.-datasheet-180549196.pdf?src-supplier=IHS; ComponentLink1Description: https://datasheet.octopart.com:443/1N5819HW-7-F-Diodes-Inc.-datasheet-180549196.pdf?src-supplier=IHS; ComponentLink2URL: https://datasheet.octopart.com:443/1N5819HW-7-F-Diodes-Inc.-datasheet-8332965.pdf?src-supplier=Upverter; ComponentLink2Description: https://datasheet.octopart.com:443/1N5819HW-7-F-Diodes-Inc.-datasheet-8332965.pdf?src-supplier=Upverter; ComponentLink3URL: https://sigma.octopart.com:443/138895985/technical_drawing/Diodes-Inc.-1N5819HW-7-F.pdf?src-supplier=Upverter; ComponentLink3Description: https://sigma.octopart.com:443/138895985/technical_drawing/Diodes-Inc.-1N5819HW-7-F.pdf?src-supplier=Upverter; ComponentLink4URL: https://datasheet.octopart.com:443/1N5819HW-7-F-Diodes-Inc.-datasheet-134530231.pdf?src-supplier=Future+Electronics; ComponentLink4Description: https://datasheet.octopart.com:443/1N5819HW-7-F-Diodes-Inc.-datasheet-134530231.pdf?src-supplier=Future+Electronics; ComponentLink5URL: https://datasheet.octopart.com:443/1N5819HW-7-F-Diodes-Inc.-datasheet-34441420.pdf?src-supplier=Future+Electronics; ComponentLink5Description: https://datasheet.octopart.com:443/1N5819HW-7-F-Diodes-Inc.-datasheet-34441420.pdf?src-supplier=Future+Electronics; ComponentLink6URL: https://datasheet.octopart.com:443/1N5819HW-7-F-Diodes-Inc.-datasheet-10497210.pdf?src-supplier=Future+Electronics; ComponentLink6Description: https://datasheet.octopart.com:443/1N5819HW-7-F-Diodes-Inc.-datasheet-10497210.pdf?src-supplier=Future+Electronics; ComponentLink7URL: https://datasheet.octopart.com:443/1N5819HW-7-F-Diodes-Inc.-datasheet-169364014.pdf?src-supplier=Newark; ComponentLink7Description: https://datasheet.octopart.com:443/1N5819HW-7-F-Diodes-Inc.-datasheet-169364014.pdf?src-supplier=Newark; ComponentLink8URL: https://datasheet.octopart.com:443/1N5819HW-7-F-Diodes-Inc.-datasheet-78715396.pdf?src-supplier=Newark; ComponentLink8Description: https://datasheet.octopart.com:443/1N5819HW-7-F-Diodes-Inc.-datasheet-78715396.pdf?src-supplier=Newark; ComponentLink9URL: https://datasheet.octopart.com:443/1N5819HW-7-F-Diodes-Inc.-datasheet-14053419.pdf?src-supplier=iiiC; ComponentLink9Description: https://datasheet.octopart.com:443/1N5819HW-7-F-Diodes-Inc.-datasheet-14053419.pdf?src-supplier=iiiC; ComponentLink10URL: https://datasheet.octopart.com:443/1N5819HW-7-F-Diodes-Inc.-datasheet-7274306.pdf?src-supplier=Jameco; ComponentLink10Description: https://datasheet.octopart.com:443/1N5819HW-7-F-Diodes-Inc.-datasheet-7274306.pdf?src-supplier=Jameco; ComponentLink11URL: https://datasheet.octopart.com:443/1N5819HW-7-F-Diodes-Inc.-datasheet-16627.pdf?src-supplier=Mouser; ComponentLink11Description: https://datasheet.octopart.com:443/1N5819HW-7-F-Diodes-Inc.-datasheet-16627.pdf?src-supplier=Mouser; ComponentLink12URL: https://datasheet.octopart.com:443/1N5819HW-7-F-Diodes-Inc.-datasheet-145195.pdf?src-supplier=DigiKey; ComponentLink12Description: https://datasheet.octopart.com:443/1N5819HW-7-F-Diodes-Inc.-datasheet-145195.pdf?src-supplier=DigiKey; ComponentLink13URL: http://sigma.octopart.com:80/15616867/materials_sheet/Diodes-Inc.-1N5819HW-7-F.pdf?src-supplier=Compliance+Statements; ComponentLink13Description: http://sigma.octopart.com:80/15616867/materials_sheet/Diodes-Inc.-1N5819HW-7-F.pdf?src-supplier=Compliance+Statements
D5 = HSMS-C150: LED Uni-Color Hi-Eff. Red 630nm 2-Pin Chip LED T/R / LED RED DIFFUSED 1206 SMD; Manufacturer: Avago; Color: Orange; Dominant Wavelength: 626nm; Forward Current: 25mA; Forward Voltage: 2.6V; Lens Color: Clear, White; Luminous Intensity: 2.8mcd; Max Junction Temperature (Tj): 95°C; Number of Circuits: 1; Power Dissipation: 65mW; Reverse Voltage: 5V; Shape: Rectangular; Test Current: 20mA; Viewing Angle: 170°; Supplier: DigiKey; Supplier Part Number: 516-1440-1-ND; Manufacturer Part Number: HSMS-C150; RoHS: Compliant; Category: LEDs; Stock: 85183; Pricing: 1=0.29, 10=0.201, 100=0.1412, 500=0.11414, 1000=0.10521 (USD); Case/Package: 1206; Case Code (Imperial): 1206; Case Code (Metric): 3216; China RoHS: Compliant; Depth: 1.6mm; Height: 1.1mm; Illumination Color: Red; Lead Free: Lead Free; Length: 3.2mm; Lens Style: Diffused; Lens Transparency: Diffused; Lifecycle Status: Production; Max Operating Temperature: 85°C; Min Operating Temperature: -40°C; Mounting Technology: Surface Mount; Number of Elements: 1; Number of LEDs: 1; Pins: 2; Number of Terminals: 2; Packaging: Cut Tape; Peak Wavelength: 630nm; Power Rating: 65mW; Radiation Hardening: No; REACH SVHC: Yes; Schedule B: 8541402000|8541402000|8541402000|8541402000|8541402000; Terminal Pitch: 2.7mm; Wavelength: 626nm; Width: 1.6mm; ComponentLink1URL: https://datasheet.octopart.com:443/HSMS-C150-Broadcom-datasheet-11546876.pdf?src-supplier=Farnell; ComponentLink1Description: https://datasheet.octopart.com:443/HSMS-C150-Broadcom-datasheet-11546876.pdf?src-supplier=Farnell; ComponentLink2URL: https://datasheet.octopart.com:443/HSMS-C150.-Avago-datasheet-505973.pdf?src-supplier=Farnell; ComponentLink2Description: https://datasheet.octopart.com:443/HSMS-C150.-Avago-datasheet-505973.pdf?src-supplier=Farnell; ComponentLink3URL: https://datasheet.octopart.com:443/HSMS-C150.-Avago-datasheet-500352.pdf?src-supplier=Farnell; ComponentLink3Description: https://datasheet.octopart.com:443/HSMS-C150.-Avago-datasheet-500352.pdf?src-supplier=Farnell; ComponentLink4URL: https://datasheet.octopart.com:443/HSMS-C150-Broadcom-datasheet-179995514.pdf?src-supplier=IHS; ComponentLink4Description: https://datasheet.octopart.com:443/HSMS-C150-Broadcom-datasheet-179995514.pdf?src-supplier=IHS; ComponentLink5URL: https://datasheet.octopart.com:443/HSMS-C150-Avago-datasheet-10307877.pdf?src-supplier=Newark; ComponentLink5Description: https://datasheet.octopart.com:443/HSMS-C150-Avago-datasheet-10307877.pdf?src-supplier=Newark; ComponentLink6URL: https://datasheet.octopart.com:443/HSMS-C150-Avago-datasheet-14175028.pdf?src-supplier=iiiC; ComponentLink6Description: https://datasheet.octopart.com:443/HSMS-C150-Avago-datasheet-14175028.pdf?src-supplier=iiiC; ComponentLink7URL: https://datasheet.octopart.com:443/HSMS-C150-Avago-datasheet-7559354.pdf?src-supplier=Future+Electronics; ComponentLink7Description: https://datasheet.octopart.com:443/HSMS-C150-Avago-datasheet-7559354.pdf?src-supplier=Future+Electronics; ComponentLink8URL: https://datasheet.octopart.com:443/HSMS-C150-Avago-datasheet-7278276.pdf?src-supplier=Jameco; ComponentLink8Description: https://datasheet.octopart.com:443/HSMS-C150-Avago-datasheet-7278276.pdf?src-supplier=Jameco; ComponentLink9URL: https://datasheet.octopart.com:443/HSMS-C150-Avago-datasheet-9899724.pdf?src-supplier=RS+(Formerly+Allied+Electronics); ComponentLink9Description: https://datasheet.octopart.com:443/HSMS-C150-Avago-datasheet-9899724.pdf?src-supplier=RS+(Formerly+Allied+Electronics); ComponentLink10URL: https://datasheet.octopart.com:443/HSMS-C150-Avago-datasheet-8432.pdf?src-supplier=DigiKey; ComponentLink10Description: https://datasheet.octopart.com:443/HSMS-C150-Avago-datasheet-8432.pdf?src-supplier=DigiKey
D6 = HSMG-C110: Surface Mount ChipLED Single Color LED, Green, Clear Untinted Nondiffused; Manufacturer: Avago; Dominant Wavelength: 572nm; Forward Current: 25mA; Forward Voltage: 2.6V; Lens Color: Clear, White; Luminous Intensity: 4.5mcd; Max Power Dissipation: 78mW; Number of Circuits: 1; Peak Wavelength: 570nm; Power Rating: 65mW; Reverse Voltage: 5V; Shape: Rectangular; Test Current: 20mA; Viewing Angle: 130°; Voltage Rating (DC): 2.2V; Supplier: DigiKey; Supplier Part Number: 516-1452-1-ND; Manufacturer Part Number: HSMG-C110; RoHS: Compliant; Category: LEDs; Stock: 2649; Pricing: 1=0.28, 10=0.194, 100=0.1365, 500=0.1102, 1000=0.10152 (USD); Case/Package: SMD/SMT; China RoHS: Compliant; Color: Green; Contact Plating: Gold; Depth: 1mm; Height: 1mm; Illumination Color: Green; Lead Free: Lead Free; Length: 3.2mm; Lens Style: Diffused; Lens Transparency: Diffused; Lifecycle Status: Production; Max Operating Temperature: 85°C; Min Operating Temperature: -40°C; Mounting Technology: Surface Mount; Number of Elements: 1; Number of LEDs: 1; Pins: 2; Number of Terminals: 3; Packaging: Cut Tape; Power Dissipation: 78mW; Radiation Hardening: No; REACH SVHC: Yes; Schedule B: 8541402000|8541402000|8541402000|8541402000|8541402000; Wavelength: 572nm; Width: 1.5mm; ComponentLink1URL: https://datasheet.octopart.com:443/HSMG-C110-Broadcom-datasheet-11546876.pdf?src-supplier=Avago; ComponentLink1Description: https://datasheet.octopart.com:443/HSMG-C110-Broadcom-datasheet-11546876.pdf?src-supplier=Avago; ComponentLink2URL: https://datasheet.octopart.com:443/HSMG-C110-Broadcom-datasheet-179995514.pdf?src-supplier=IHS; ComponentLink2Description: https://datasheet.octopart.com:443/HSMG-C110-Broadcom-datasheet-179995514.pdf?src-supplier=IHS; ComponentLink3URL: https://datasheet.octopart.com:443/HSMG-C110-Avago-datasheet-10307877.pdf?src-supplier=Newark; ComponentLink3Description: https://datasheet.octopart.com:443/HSMG-C110-Avago-datasheet-10307877.pdf?src-supplier=Newark; ComponentLink4URL: https://datasheet.octopart.com:443/HSMG-C110-Broadcom-datasheet-26698224.pdf?src-supplier=Newark; ComponentLink4Description: https://datasheet.octopart.com:443/HSMG-C110-Broadcom-datasheet-26698224.pdf?src-supplier=Newark; ComponentLink5URL: https://datasheet.octopart.com:443/HSMG-C110-Avago-datasheet-8329607.pdf?src-supplier=Future+Electronics; ComponentLink5Description: https://datasheet.octopart.com:443/HSMG-C110-Avago-datasheet-8329607.pdf?src-supplier=Future+Electronics; ComponentLink6URL: https://datasheet.octopart.com:443/HSMG-C110-Avago-datasheet-7834016.pdf?src-supplier=Jameco; ComponentLink6Description: https://datasheet.octopart.com:443/HSMG-C110-Avago-datasheet-7834016.pdf?src-supplier=Jameco; ComponentLink7URL: https://datasheet.octopart.com:443/HSMG-C110-Avago-datasheet-8432.pdf?src-supplier=DigiKey; ComponentLink7Description: https://datasheet.octopart.com:443/HSMG-C110-Avago-datasheet-8432.pdf?src-supplier=DigiKey
D7 = HSMY-C170: LED YELLOW DIFFUSED CHIP SMD Yellow 586nm LED Indication - Discrete 2.1V 0805 (2012 Metric); Manufacturer: Avago; Forward Current: 20mA; Forward Voltage: 2.6V; Lens Color: Clear, White; Luminous Intensity: 2.8mcd; Max Power Dissipation: 52mW; Number of Circuits: 1; Peak Wavelength: 589nm; Reverse Voltage: 5V; Shape: Rectangular; Viewing Angle: 170°; Supplier: DigiKey; Supplier Part Number: 516-1433-1-ND; Manufacturer Part Number: HSMY-C170; RoHS: Compliant; Category: LEDs; Stock: 56777; Pricing: 1=0.3, 10=0.204, 100=0.1435, 500=0.1161, 1000=0.10704, 2000=0.09931 (USD); Case/Package: 0805; Case Code (Imperial): 0805; Case Code (Metric): 2012; China RoHS: Compliant; Color: Yellow; Contact Plating: Gold; Depth: 1.25mm; Dominant Wavelength: 586nm; Height: 800µm; Illumination Color: Yellow; Lead Free: Lead Free; Length: 2mm; Lens Style: Diffused; Lens Transparency: Diffused; Lifecycle Status: Production; Max Operating Temperature: 85°C; Min Operating Temperature: -40°C; Mounting Technology: Surface Mount; Number of Elements: 1; Number of LEDs: 1; Pins: 2; Number of Terminals: 2; Packaging: Cut Tape; Power Dissipation: 52mW; Power Rating: 52mW; Radiation Hardening: No; REACH SVHC: Yes; Schedule B: 8541402000|8541402000|8541402000|8541402000|8541402000; Terminal Pitch: 1.6mm; Test Current: 20mA; Wavelength: 586nm; Width: 1.25mm; ComponentLink1URL: https://datasheet.octopart.com:443/HSMY-C170-Broadcom-datasheet-11546876.pdf?src-supplier=Avago; ComponentLink1Description: https://datasheet.octopart.com:443/HSMY-C170-Broadcom-datasheet-11546876.pdf?src-supplier=Avago; ComponentLink2URL: https://datasheet.octopart.com:443/HSMY-C170-Broadcom-datasheet-179995514.pdf?src-supplier=IHS; ComponentLink2Description: https://datasheet.octopart.com:443/HSMY-C170-Broadcom-datasheet-179995514.pdf?src-supplier=IHS; ComponentLink3URL: https://datasheet.octopart.com:443/HSMY-C170-Avago-datasheet-10307877.pdf?src-supplier=Newark; ComponentLink3Description: https://datasheet.octopart.com:443/HSMY-C170-Avago-datasheet-10307877.pdf?src-supplier=Newark; ComponentLink4URL: https://datasheet.octopart.com:443/HSMY-C170-Broadcom-datasheet-26698234.pdf?src-supplier=Newark; ComponentLink4Description: https://datasheet.octopart.com:443/HSMY-C170-Broadcom-datasheet-26698234.pdf?src-supplier=Newark; ComponentLink5URL: https://datasheet.octopart.com:443/HSMY-C170-Avago-datasheet-7559354.pdf?src-supplier=element14+APAC; ComponentLink5Description: https://datasheet.octopart.com:443/HSMY-C170-Avago-datasheet-7559354.pdf?src-supplier=element14+APAC; ComponentLink6URL: https://datasheet.octopart.com:443/HSMY-C170-Avago-datasheet-8432.pdf?src-supplier=Farnell; ComponentLink6Description: https://datasheet.octopart.com:443/HSMY-C170-Avago-datasheet-8432.pdf?src-supplier=Farnell; ComponentLink7URL: https://datasheet.octopart.com:443/HSMY-C170-Avago-datasheet-10459301.pdf?src-supplier=Jameco; ComponentLink7Description: https://datasheet.octopart.com:443/HSMY-C170-Avago-datasheet-10459301.pdf?src-supplier=Jameco